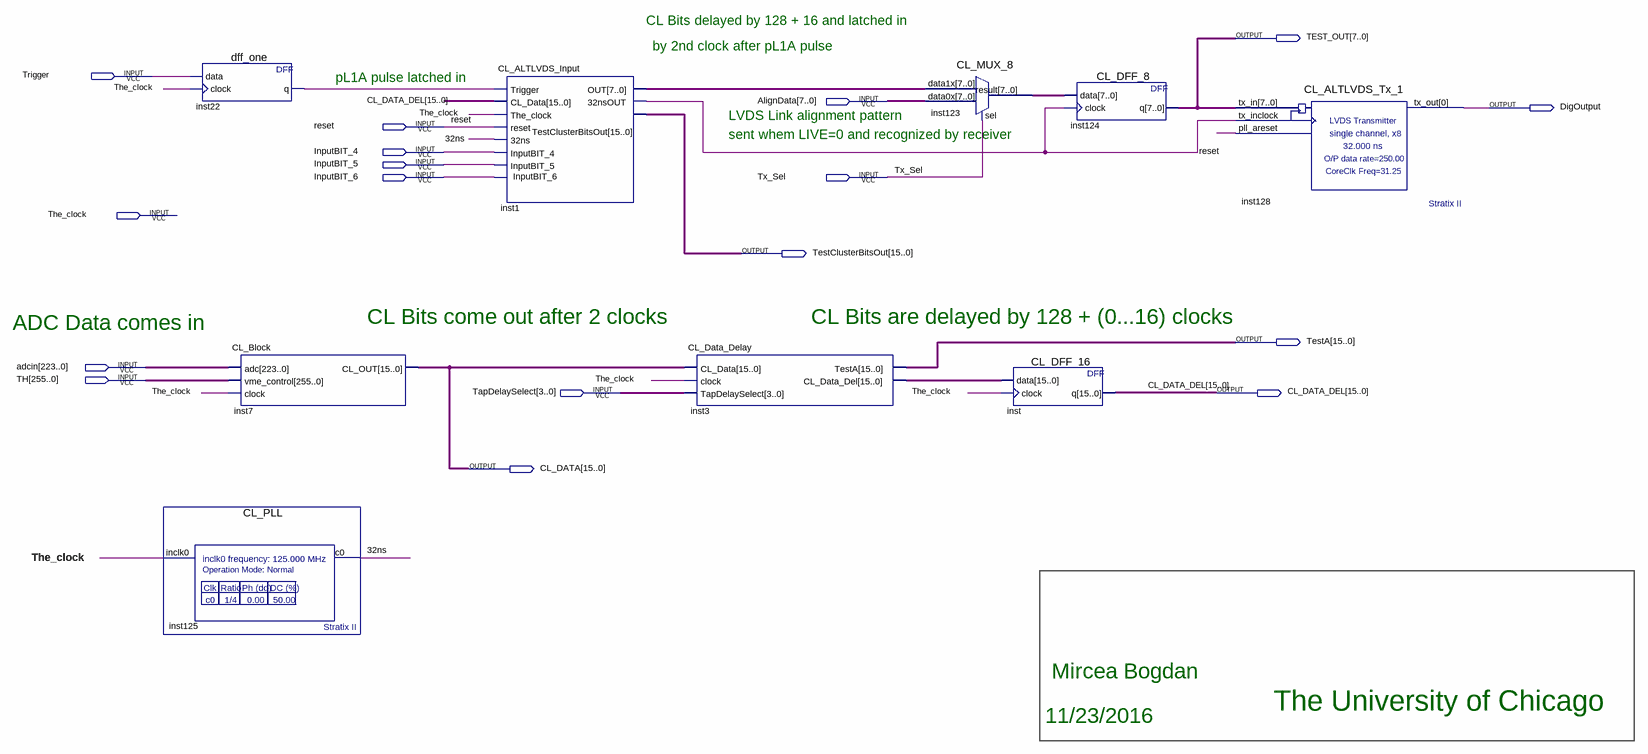
[diagram p0: schematic sheet]
// Quartus schematic CL_TOP.bdf as structural Verilog: 9 symbols, 17 pins
module CL_TOP (
  input  Trigger,
  input  [7:0] AlignData,
  input  reset,
  input  InputBIT_4,
  input  InputBIT_5,
  input  InputBIT_6,
  input  Tx_Sel,
  input  The_clock,
  input  [223:0] adcin,
  input  [255:0] TH,
  input  [3:0] TapDelaySelect,
  output [7:0] TEST_OUT,
  output DigOutput,
  output [15:0] TestClusterBitsOut,
  output [15:0] TestA,
  output [15:0] CL_DATA_DEL,
  output [15:0] CL_DATA
);

  wire \32ns , inst1_32nsout, inst22_q;
  wire [7:0] inst1_out, inst123_result;
  wire [15:0] inst3_cl_data_del;

  CL_PLL inst125 (.inclk0(The_clock), .c0(\32ns ));
  dff_one inst22 (.data(Trigger), .clock(The_clock), .q(inst22_q));
  CL_Block inst7 (.adc(adcin), .vme_control(TH), .clock(The_clock), .CL_OUT(CL_DATA));
  CL_ALTLVDS_Input inst1 (
    .Trigger(inst22_q), .CL_Data(CL_DATA_DEL), .The_clock(The_clock), .reset(reset), .\32ns (\32ns ),
    .InputBIT_4(InputBIT_4), .InputBIT_5(InputBIT_5), .InputBIT_6(InputBIT_6), .OUT(inst1_out),
    .\32nsOUT (inst1_32nsout), .TestClusterBitsOut(TestClusterBitsOut));
  CL_Data_Delay inst3 (
    .CL_Data(CL_DATA), .clock(The_clock), .TapDelaySelect(TapDelaySelect), .TestA(TestA),
    .CL_Data_Del(inst3_cl_data_del));
  CL_MUX_8 inst123 (.data1x(inst1_out), .data0x(AlignData), .sel(Tx_Sel), .result(inst123_result));
  CL_DFF_16 inst (.data(inst3_cl_data_del), .clock(The_clock), .q(CL_DATA_DEL));
  CL_DFF_8 inst124 (.data(inst123_result), .clock(inst1_32nsout), .q(TEST_OUT));
  CL_ALTLVDS_Tx_1 inst128 (.tx_in(TEST_OUT), .tx_inclock(inst1_32nsout), .pll_areset(reset), .tx_out(DigOutput));

  // Notes on the sheet:
  //   CL Bits delayed by 128 + 16 and latched in
  //   by 2nd clock after pL1A pulse
  //   pL1A pulse latched in
  //   LVDS Link alignment pattern
  //   sent whem LIVE=0 and recognized by receiver
  //   CL Bits come out after 2 clocks
  //   CL Bits are delayed by 128 + (0...16) clocks
  //   ADC Data comes in
  //   Mircea Bogdan
  //   The University of Chicago
  //   11/23/2016
endmodule
